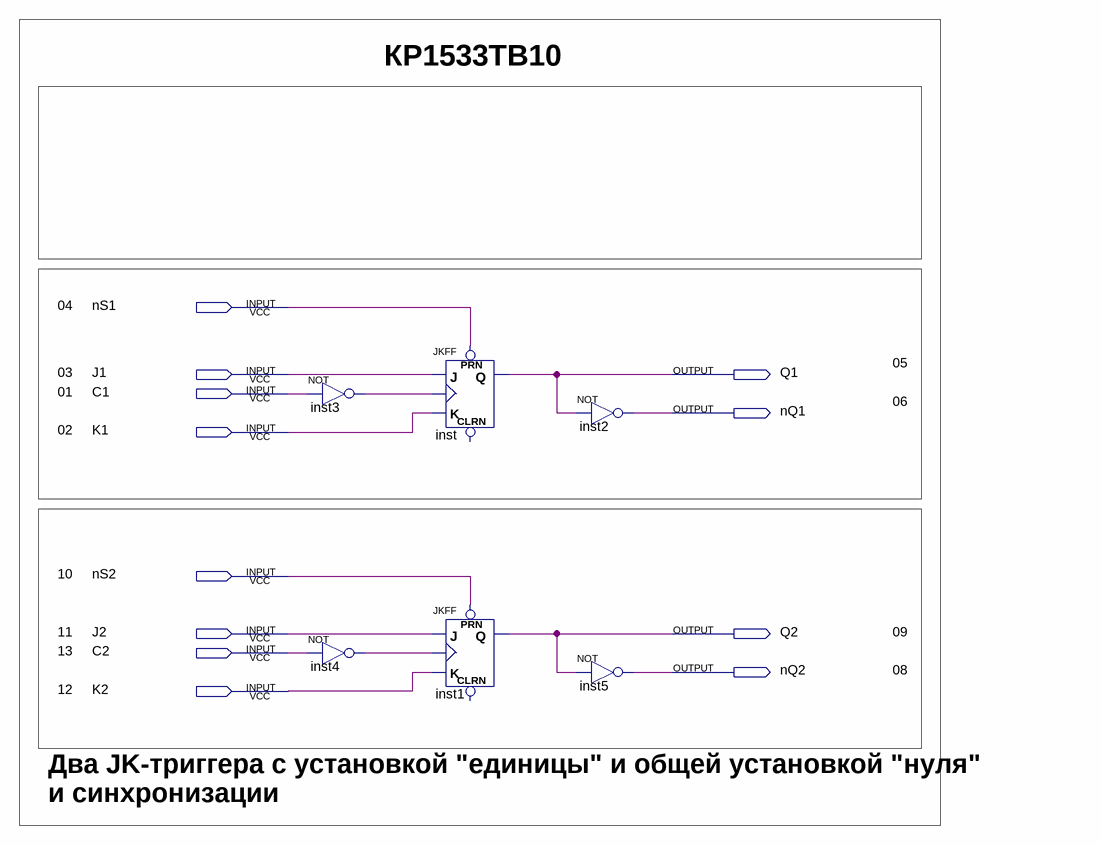
[diagram p0: schematic sheet]
// Quartus schematic KP1533TB10.bdf as structural Verilog: 6 symbols, 12 pins
module KP1533TB10 (
  input  nS1,
  input  J1,
  input  C1,
  input  K1,
  input  nS2,
  input  J2,
  input  C2,
  input  K2,
  output Q1,
  output nQ1,
  output Q2,
  output nQ2
);

  wire inst3_out, inst4_out;

  not inst3 (inst3_out, C1);
  not inst4 (inst4_out, C2);
  JKFF inst (.PRN(nS1), .K(K1), .J(J1), .CLK(inst3_out), .Q(Q1));  // open: CLRN
  JKFF inst1 (.PRN(nS2), .K(K2), .J(J2), .CLK(inst4_out), .Q(Q2));  // open: CLRN
  not inst2 (nQ1, Q1);
  not inst5 (nQ2, Q2);

  // Notes on the sheet:
  //   КР1533ТВ10
  //   04
  //   05
  //   03
  //   01
  //   06
  //   02
  //   10
  //   11
  //   09
  //   13
  //   08
  //   12
  //   Два JK-триггера с установкой "единицы" и общей установкой "нуля"
  //   и синхронизации
endmodule
